# Altium schematic sheet USB Control Unit (UCU).SchDoc
size A; SheetNumber: 2; SheetTotal: 5
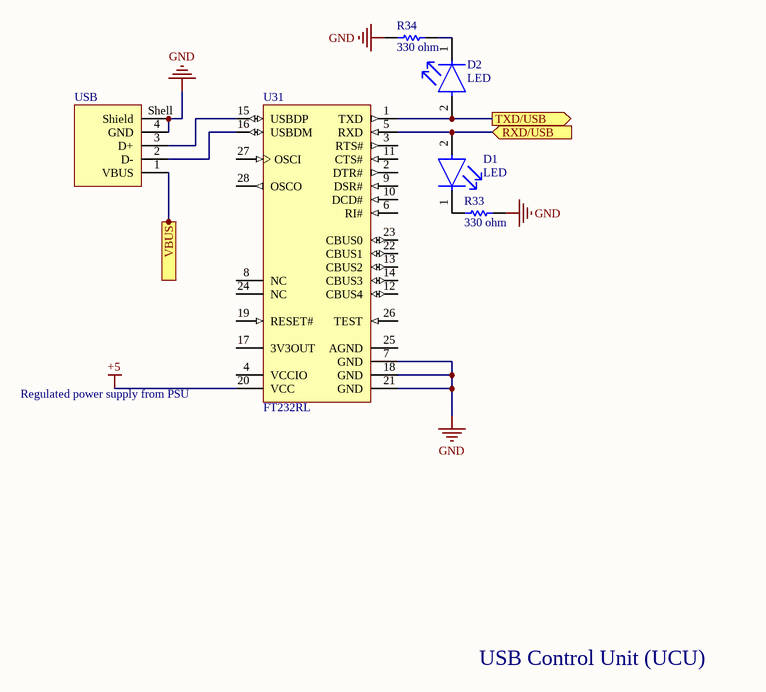
[diagram p0: USB Control Unit (UCU).SchDoc]

## Parts
D1  LED  [FP-LTST-S270KRKT-MFG]
D2  LED  [FP-LTST-S270KRKT-MFG]
R33  330 ohm  [RESC1608X55X30LL15T15]
R34  330 ohm  [RESC1608X55X30LL15T15]
U31  FT232RL  [FTDI-SSOP-28_M]
USB  61400416121  [61400416121]  (value not drawn)

## Ports
RXD/USB (in), TXD/USB (out), VBUS (out)

## Nets
+5: U31.20(VCC)
GND: R33.1 R34.1 U31.7(GND) U31.18(GND) U31.21(GND) USB.4(GND) USB.Shell(Shield)
RXD/USB: D1.2(A) U31.5(RXD) ; port RXD/USB
TXD/USB: D2.2(A) U31.1(TXD) ; port TXD/USB
VBUS: USB.1(VBUS) ; port VBUS
NetD1_1: D1.1(C) R33.2
NetD2_1: D2.1(C) R34.2
NetU31_15: U31.15(USBDP) USB.3(D+)
NetU31_16: U31.16(USBDM) USB.2(D-)

Not connected (* = marked no-connect by the designer): U31 2(DTR#) 3(RTS#) 4(VCCIO) 6(RI#) 8(NC) 9(DSR#) 10(DCD#) 11(CTS#) 12(CBUS4) 13(CBUS2) 14(CBUS3) 17(3V3OUT) 19(RESET#) 22(CBUS1) 23(CBUS0) 24(NC) 25(AGND) 26(TEST) 27(OSCI) 28(OSCO)

## Notes on the sheet
- Regulated power supply from PSU
- USB Control Unit (UCU)

## Library data of the parts
D1 D2 = CMP-2000-06630-2: LED RED CLEAR CHIP SMD R/A; Test Current: 20mA; Number of LEDs: 1; Power Rating: 75mW; Lens Style: Diffused; Luminous Intensity: 54mcd; Wavelength: 639nm; Dominant Wavelength: 631nm; Lens Color: Colorless; Forward Voltage: 2V; Viewing Angle: 130°; Forward Current: 30mA; Reverse Voltage: 5V; Illumination Color: Red; Case Code (Imperial): 0603; Color: Red; Packaging: Tape and Reel; Number of Pins: 2; Length: 1.6mm; Lens Transparency: Clear; Width: 1.15mm; Power Dissipation: 75mW; Lead Free: Lead Free; Max Power Dissipation: 75mW; Case/Package: 0603; Max Operating Temperature: 85°C; Mount: Surface Mount; Depth: 0.6mm; Number of Elements: 1; Radiation Hardening: No; Case Code (Metric): 1608; Package Quantity: 1; Height: 0.6mm; Min Operating Temperature: -55°C
R33 R34 = CMP-2000-00435-2: Chip Resistor, 330 Ohm, +/- 1%, 0.1 W, -55 to 155 degC, 0603 (1608 Metric), RoHS, Tape and Reel; Gender: Male; Mating Cycles: 10000; Current Rating: 500 mA; Voltage Rating: 10 V; REACH SVHC: No SVHC; PackageDescription: 2-Pin Surface Mount Device, Body 1.6 x 0.85 mm; Contact Finish: Gold; Pins: 8; ComponentLink1Description: Manufacturer URL; Packaging: Tape and Reel; Max Operating Temperature: 85 degC; Contact Material: Copper; Height: 1.45 mm; Width: 1.45 mm; DatasheetVersion: Apr-15; Package Quantity: 1500; Contact Plating: Gold; PackageReference: 0603; Mount: Surface Mount; Lead Pitch: 1.1 mm; Min Operating Temperature: -25 degC; ComponentLink1URL: http://www.panasonic.com/; ComponentLink2URL: http://industrial.panasonic.com/cdbs/www-data/pdf/RDA0000/AOA0000C86.pdf; Length: 13.7 mm; ComponentLink2Description: Datasheet; RoHSCompliant: true
U31 = CMP-2000-05029-1: IC USB FS SERIAL UART 28-SSOP; Manufacturer: FTDI; Receive FIFO: 256B; Number of Channels per Chip: 1; Maximum Data Rate: 3MBd; Transmit FIFO: 128B; Dimensions: 10.2x5.3x1.75mm; Mounting Type: SurfaceMount; Height: 1.75mm; Package Type: SSOP; Datasheet Version: Rev. 1.04, 02/2006; Width: 5.3mm; Manufacturer URL: http://www.ftdichip.com/; Datasheet URL: http://datasheet.octopart.com/FT232RL-FTDI-datasheet-120501.pdf; Maximum Operating Temperature: +85degC; Minimum Operating Temperature: -40degC; Pin Count: 28; Length: 10.2mm
USB = CMP-1502-03243-3: NexarPartId: 21041529; Operating Supply Voltage: 30V; Gender: Receptacle; Number of Contacts: 4; Current Rating: 1.5A; Connector Type: USB; Contact Resistance: 20mΩ; Insulation Resistance: 1GΩ; USB Standard: USB 2.0; Number of Ports: 1; REACH SVHC: Unknown; Termination: Solder; Color: White; Contact Plating: Gold; Flammability Rating: UL94 V-0; Voltage Rating: 30V; Insulation Material: PBT; Number of Positions: 4; Number of Pins: 4; Max Operating Temperature: 105°C; Min Operating Temperature: -40°C; Width: 16.2mm; RoHS: Compliant; Contact Material: Gold; Orientation: Horizontal; Height: 11.25mm; Mount: Horizontal, PCB, Through Hole; Length: 14.7mm; Voltage Rating (DC): 30V